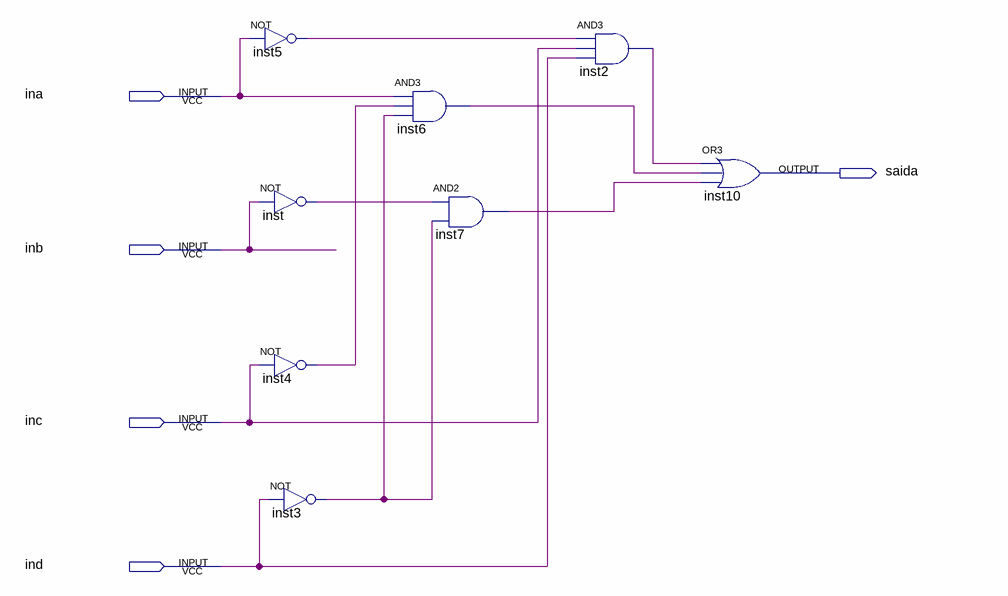
[diagram p0: schematic sheet]
// Quartus schematic e.bdf as structural Verilog: 8 symbols, 5 pins
module e (
  input  ina,
  input  inb,
  input  inc,
  input  ind,
  output saida
);

  wire inst2_out, inst3_out, inst4_out, inst5_out, inst6_out, inst7_out, inst_out;

  not inst5 (inst5_out, ina);
  not inst (inst_out, inb);
  not inst4 (inst4_out, inc);
  not inst3 (inst3_out, ind);
  and inst6 (inst6_out, ina, inst4_out, inst3_out);
  and inst7 (inst7_out, inst_out, inst3_out);
  and inst2 (inst2_out, inst5_out, inc, ind);
  or inst10 (saida, inst2_out, inst6_out, inst7_out);
endmodule
